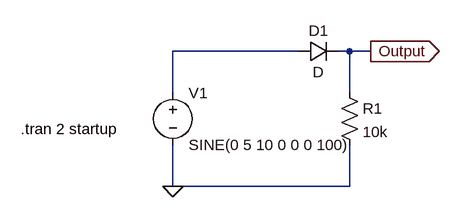
[diagram p0: schematic Half Wave rectifier.asc]
Half Wave rectifier.asc, the LTspice schematic file:
Version 4
SHEET 1 880 680
WIRE 192 64 0 64
WIRE 272 64 256 64
WIRE 304 64 272 64
WIRE 0 128 0 64
WIRE 272 128 272 64
WIRE 0 272 0 208
WIRE 272 272 272 208
WIRE 272 272 0 272
FLAG 304 64 Output
IOPIN 304 64 Out
FLAG 0 272 0
SYMBOL voltage 0 112 R0
WINDOW 123 0 0 Left 0
WINDOW 39 0 0 Left 0
SYMATTR InstName V1
SYMATTR Value SINE(0 5 10 0 0 0 100)
SYMBOL diode 192 80 R270
WINDOW 0 32 32 VTop 2
WINDOW 3 0 32 VBottom 2
SYMATTR InstName D1
SYMBOL res 256 112 R0
SYMATTR InstName R1
SYMATTR Value 10k
TEXT -234 184 Left 2 !.tran 2 startup

The netlist it stands for:
* Half Wave rectifier.asc
V1 N001 0 SINE(0 5 10 0 0 0 100)
D1 N001 Output D
R1 Output 0 10k
.model D D
.lib standard.dio
.tran 2 startup
.backanno
.end